# Altium project OBC Development Board.PrjPcb
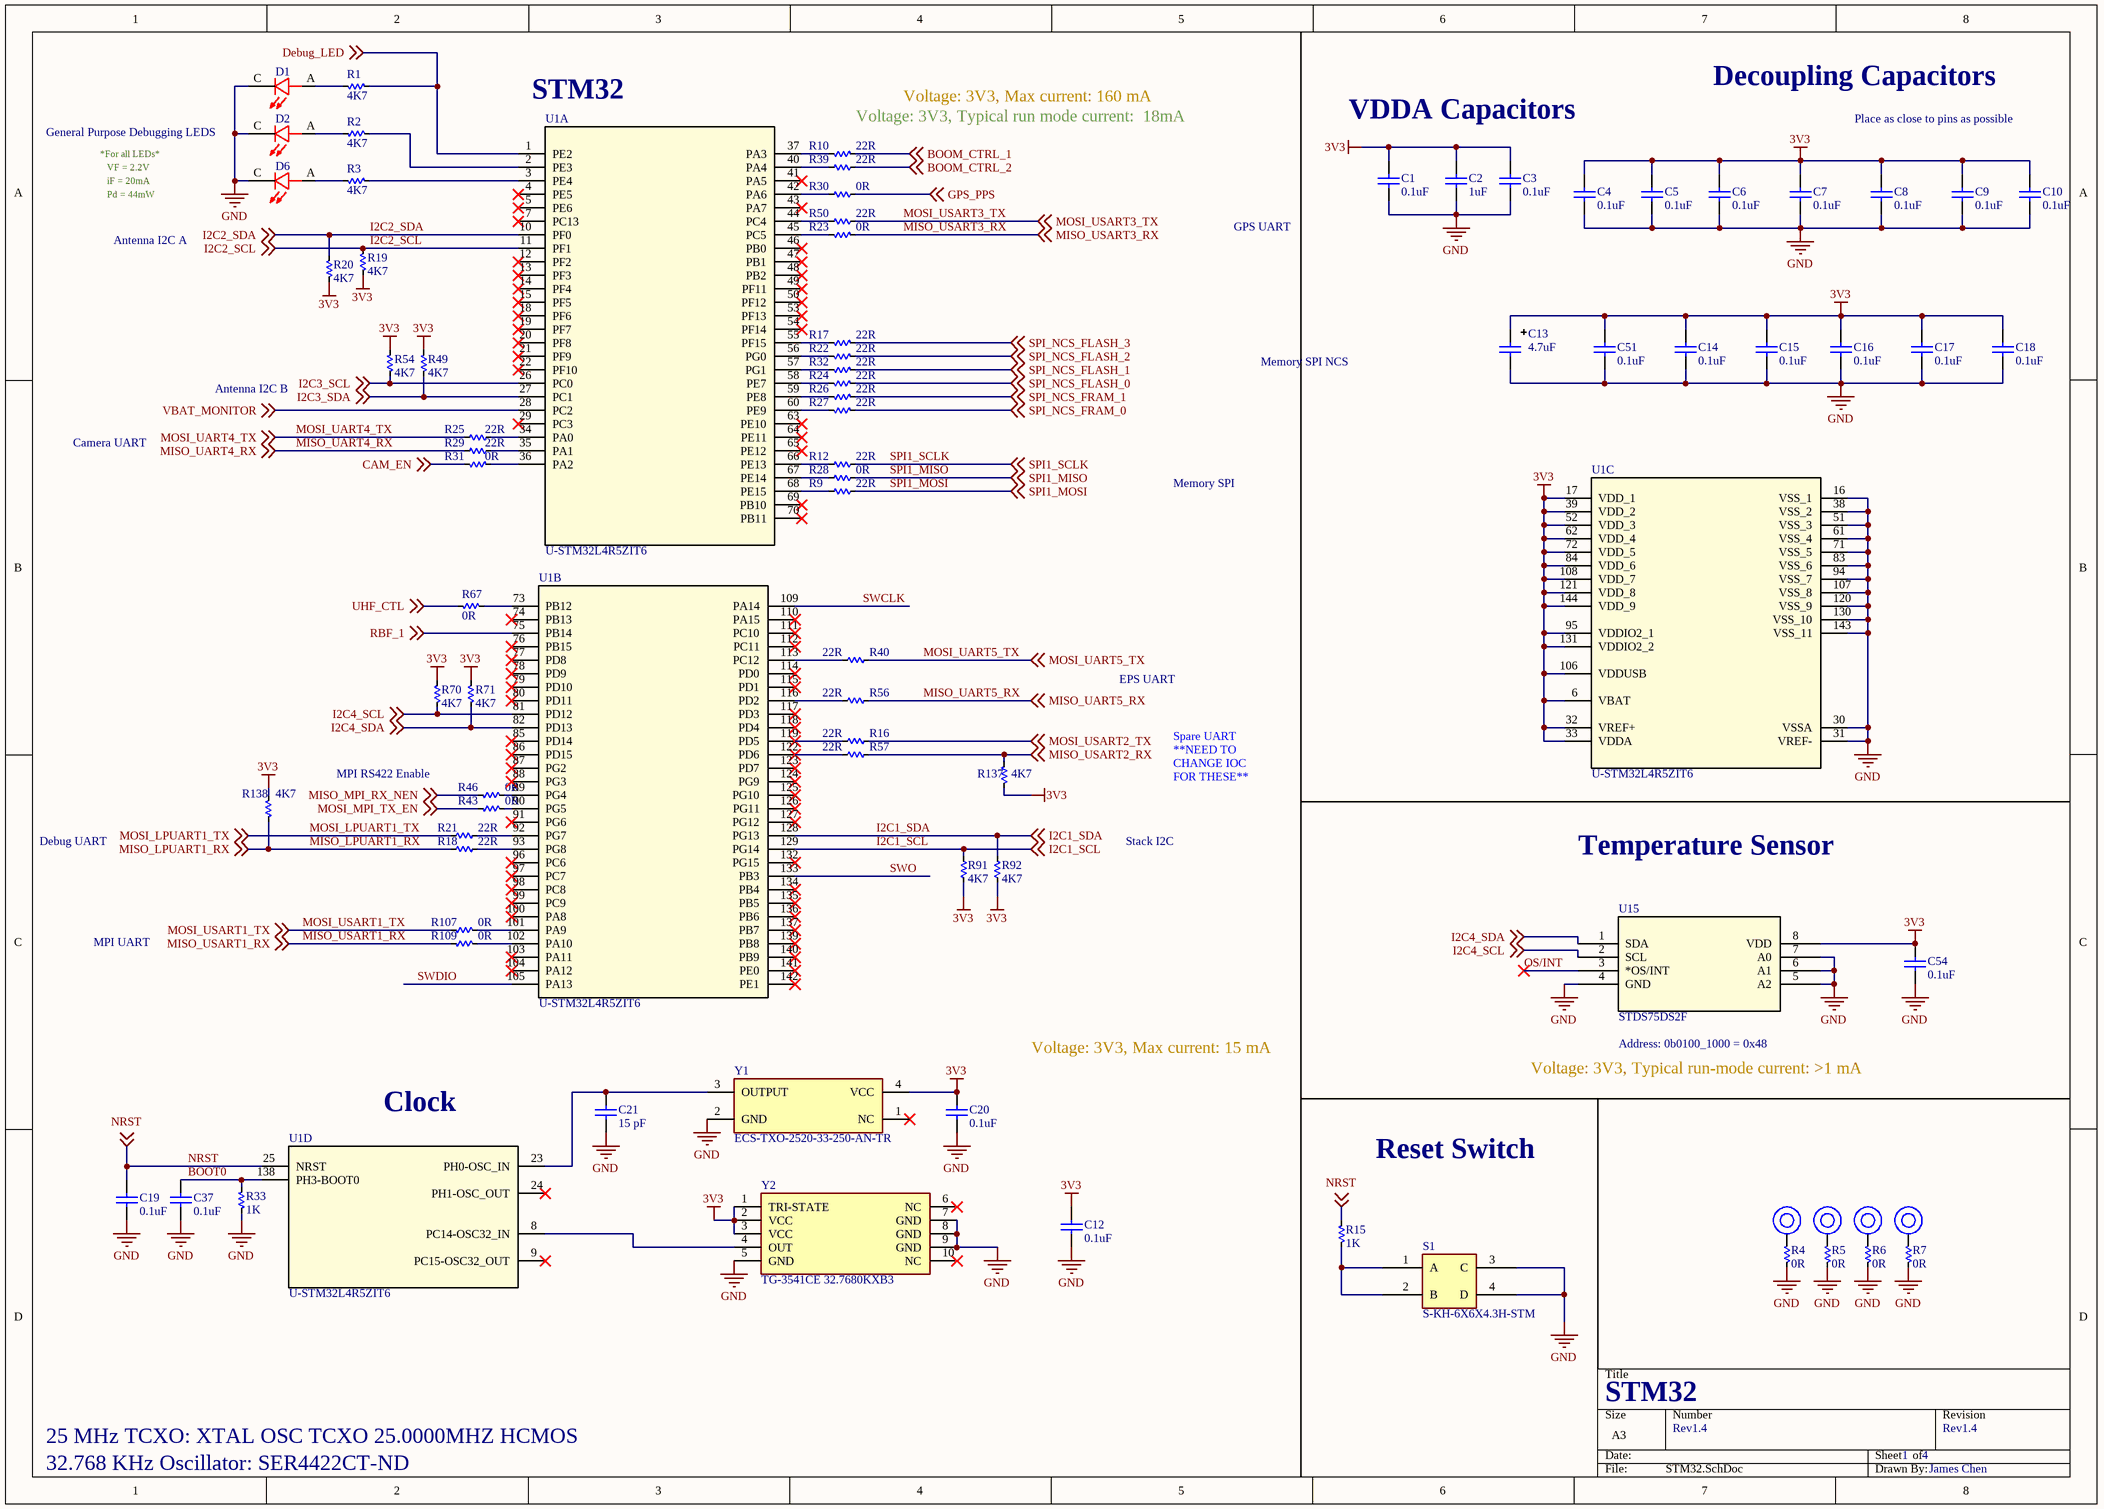
[diagram p0: STM32.SchDoc]
4 sheets, 225 parts. Net scope: global (net labels, ports and power ports of the same name join across sheets).
Board file: OBC Development Board.PcbDoc
Sheets:
  STM32.SchDoc
  Memory.SchDoc
  External Connectors.SchDoc
  Antenna and LoRa.SchDoc

## Sheet STM32.SchDoc
size A3; SheetNumber: 1; SheetTotal: 4

### Parts
*1  PC104 Mounting  [PC104 Mounting Points]  (value not drawn)  (no BOM)
*2  PC104 Mounting  [PC104 Mounting Points]  (value not drawn)  (no BOM)
*3  PC104 Mounting  [PC104 Mounting Points]  (value not drawn)  (no BOM)
*4  PC104 Mounting  [PC104 Mounting Points]  (value not drawn)  (no BOM)
C1  0.1uF  [0603]
C2  1uF  [0603]
C3  0.1uF  [0603]
C4  0.1uF  [0603]
C5  0.1uF  [0603]
C6  0.1uF  [0603]
C7  0.1uF  [0603]
C8  0.1uF  [0603]
C9  0.1uF  [0603]
C10  0.1uF  [0603]
C12  0.1uF  [0603]
C13  4.7uF  [CAP TANT 1206 (A) TCJ]
C14  0.1uF  [0603]
C15  0.1uF  [0603]
C16  0.1uF  [0603]
C17  0.1uF  [0603]
C18  0.1uF  [0603]
C19  0.1uF  [0603]
C20  0.1uF  [0603]
C21  15 pF  [0402]
C37  0.1uF  [0402]
C51  0.1uF  [0603]
C54  0.1uF  [0603]
D1  D-SML-D12U1WT86  [D-SML-D12U1WT86]  (value not drawn)
D2  D-SML-D12U1WT86  [D-SML-D12U1WT86]  (value not drawn)
D6  D-SML-D12U1WT86  [D-SML-D12U1WT86]  (value not drawn)
R1  4K7  [0603]
R2  4K7  [0603]
R3  4K7  [0603]
R4  value 0R  [0603]  (hidden comment: 0R DNP)
R5  value 0R  [0603]  (hidden comment: 0R DNP)
R6  value 0R  [0603]  (hidden comment: 0R DNP)
R7  value 0R  [0603]  (hidden comment: 0R DNP)
R9  22R  [0603]
R10  22R  [0603]
R12  22R  [0603]
R15  1K  [0603]
R16  22R  [0603]
R17  22R  [0603]
R18  22R  [0603]
R19  4K7  [0603]
R20  4K7  [0603]
R21  22R  [0603]
R22  22R  [0603]
R23  0R  [0603]
R24  22R  [0603]
R25  22R  [0603]
R26  22R  [0603]
R27  22R  [0603]
R28  0R  [0603]
R29  22R  [0603]
R30  0R  [0603]
R31  0R  [0603]
R32  22R  [0603]
R33  1K  [0603]
R39  22R  [0603]
R40  22R  [0603]
R43  0R  [0603]
R46  0R  [0603]
R49  4K7  [0603]
R50  22R  [0603]
R54  4K7  [0603]
R56  22R  [0603]
R57  22R  [0603]
R67  0R  [0603]
R70  4K7  [0603]
R71  4K7  [0603]
R91  4K7  [0603]
R92  4K7  [0603]
R107  0R  [0603]
R109  0R  [0603]
R137  4K7  [0603]
R138  4K7  [0603]
S1  S-KH-6X6X4.3H-STM  [S-KH-6X6X4.3H-STM]
U1  U-STM32L4R5ZIT6  [U-STM32L4R5ZIT6]  (parts A,B,C,D of 4)
U15  STDS75DS2F  [MSOP-8_STM-M]
Y1  ECS-TXO-2520-33-250-AN-TR  [Y-ECS-TXO-2520-33-250-AN-TR]
Y2  TG-3541CE 32.7680KXB3  [Y-TG-3541CE 32.7680KXB3]

### Nets
3V3: C1.2 C2.2 C3.2 C4.2 C5.2 C6.2 C7.2 C8.2 C9.2 C10.2 C12.2 C13.1 C14.2 C15.2 C16.2 C17.2 C18.2 C20.2 C51.2 C54.2 R19.1 R20.1 R49.1 R54.1 R70.1 R71.1 R91.2 R92.1 R137.2 R138.1 U1.6(VBAT) U1.17(VDD_1) U1.32(VREF+) U1.33(VDDA) U1.39(VDD_2) U1.52(VDD_3) U1.62(VDD_4) U1.72(VDD_5) U1.84(VDD_6) U1.95(VDDIO2_1) U1.106(VDDUSB) U1.108(VDD_7) U1.121(VDD_8) U1.131(VDDIO2_2) U1.144(VDD_9) U15.8(VDD) Y1.4(VCC) Y2.1(TRI-STATE) Y2.2(VCC) Y2.3(VCC)
GND: C1.1 C2.1 C3.1 C4.1 C5.1 C6.1 C7.1 C8.1 C9.1 C10.1 C12.1 C13.2 C14.1 C15.1 C16.1 C17.1 C18.1 C19.1 C20.1 C21.2 C37.2 C51.1 C54.1 D1.C D2.C D6.C R4.1 R5.1 R6.1 R7.1 R33.1 S1.3(C) S1.4(D) U1.16(VSS_1) U1.30(VSSA) U1.31(VREF-) U1.38(VSS_2) U1.51(VSS_3) U1.61(VSS_4) U1.71(VSS_5) U1.83(VSS_6) U1.94(VSS_7) U1.107(VSS_8) U1.120(VSS_9) U1.130(VSS_10) U1.143(VSS_11) U15.4(GND) U15.5(A2) U15.6(A1) U15.7(A0) Y1.2(GND) Y2.5(GND) Y2.7(GND) Y2.8(GND) Y2.9(GND)
BOOM_CTRL_1: R10.2 ; off-sheet BOOM_CTRL_1
BOOM_CTRL_2: R39.1 ; off-sheet BOOM_CTRL_2
BOOT0: C37.1 R33.2 U1.138(PH3-BOOT0)
CAM_EN: R31.1 ; off-sheet CAM_EN
Debug_LED: R1.2 U1.1(PE2) ; off-sheet Debug_LED
GPS_PPS: R30.2 ; off-sheet GPS_PPS
I2C1_SCL: R91.1 U1.129(PG14) ; off-sheet I2C1_SCL
I2C1_SDA: R92.2 U1.128(PG13) ; off-sheet I2C1_SDA
I2C2_SCL: R19.2 U1.11(PF1) ; off-sheet I2C2_SCL
I2C2_SDA: R20.2 U1.10(PF0) ; off-sheet I2C2_SDA
I2C3_SCL: R54.2 U1.26(PC0) ; off-sheet I2C3_SCL
I2C3_SDA: R49.2 U1.27(PC1) ; off-sheet I2C3_SDA
I2C4_SCL: R70.2 U1.81(PD12) U15.2(SCL) ; off-sheet I2C4_SCL
I2C4_SDA: R71.2 U1.82(PD13) U15.1(SDA) ; off-sheet I2C4_SDA
MISO_LPUART1_RX: R18.1 R138.2 ; off-sheet MISO_LPUART1_RX
MISO_MPI_RX_NEN: R46.2 ; off-sheet MISO_MPI_RX_NEN
MISO_UART4_RX: R29.1 ; off-sheet MISO_UART4_RX
MISO_UART5_RX: R56.2 ; off-sheet MISO_UART5_RX
MISO_USART1_RX: R109.1 ; off-sheet MISO_USART1_RX
MISO_USART2_RX: R57.2 R137.1 ; off-sheet MISO_USART2_RX
MISO_USART3_RX: R23.2 ; off-sheet MISO_USART3_RX
MOSI_LPUART1_TX: R21.1 ; off-sheet MOSI_LPUART1_TX
MOSI_MPI_TX_EN: R43.2 ; off-sheet MOSI_MPI_TX_EN
MOSI_UART4_TX: R25.1 ; off-sheet MOSI_UART4_TX
MOSI_UART5_TX: R40.2 ; off-sheet MOSI_UART5_TX
MOSI_USART1_TX: R107.1 ; off-sheet MOSI_USART1_TX
MOSI_USART2_TX: R16.2 ; off-sheet MOSI_USART2_TX
MOSI_USART3_TX: R50.1 ; off-sheet MOSI_USART3_TX
NRST: C19.2 R15.2 U1.25(NRST) ; off-sheet NRST
OS/INT: U15.3(*OS/INT)
RBF_1: U1.75(PB14) ; off-sheet RBF_1
SPI1_MISO: R28.2 ; off-sheet SPI1_MISO
SPI1_MOSI: R9.1 ; off-sheet SPI1_MOSI
SPI1_SCLK: R12.1 ; off-sheet SPI1_SCLK
SPI_NCS_FLASH_0: R24.2 ; off-sheet SPI_NCS_FLASH_0
SPI_NCS_FLASH_1: R32.2 ; off-sheet SPI_NCS_FLASH_1
SPI_NCS_FLASH_2: R22.2 ; off-sheet SPI_NCS_FLASH_2
SPI_NCS_FLASH_3: R17.2 ; off-sheet SPI_NCS_FLASH_3
SPI_NCS_FRAM_0: R27.2 ; off-sheet SPI_NCS_FRAM_0
SPI_NCS_FRAM_1: R26.2 ; off-sheet SPI_NCS_FRAM_1
SWCLK: U1.109(PA14)
SWDIO: U1.105(PA13)
SWO: U1.133(PB3)
UHF_CTL: R67.1 ; off-sheet UHF_CTL
VBAT_MONITOR: U1.28(PC2) ; off-sheet VBAT_MONITOR
Net*1_1: *1.1 R4.2
Net*2_1: *2.1 R5.2
Net*3_1: *3.1 R6.2
Net*4_1: *4.1 R7.2
NetC21_1: C21.1 U1.23(PH0-OSC_IN) Y1.3(OUTPUT)
NetD1_A: D1.A R1.1
NetD2_A: D2.A R2.1
NetD6_A: D6.A R3.2
NetR2_2: R2.2 U1.2(PE3)
NetR3_1: R3.1 U1.3(PE4)
NetR9_2: R9.2 U1.68(PE15)
NetR10_1: R10.1 U1.37(PA3)
NetR12_2: R12.2 U1.66(PE13)
NetR15_1: R15.1 S1.1(A) S1.2(B)
NetR16_1: R16.1 U1.119(PD5)
NetR17_1: R17.1 U1.55(PF15)
NetR18_2: R18.2 U1.93(PG8)
NetR21_2: R21.2 U1.92(PG7)
NetR22_1: R22.1 U1.56(PG0)
NetR23_1: R23.1 U1.45(PC5)
NetR24_1: R24.1 U1.58(PE7)
NetR25_2: R25.2 U1.34(PA0)
NetR26_1: R26.1 U1.59(PE8)
NetR27_1: R27.1 U1.60(PE9)
NetR28_1: R28.1 U1.67(PE14)
NetR29_2: R29.2 U1.35(PA1)
NetR30_1: R30.1 U1.42(PA6)
NetR31_2: R31.2 U1.36(PA2)
NetR32_1: R32.1 U1.57(PG1)
NetR39_2: R39.2 U1.40(PA4)
NetR40_1: R40.1 U1.113(PC12)
NetR43_1: R43.1 U1.90(PG5)
NetR46_1: R46.1 U1.89(PG4)
NetR50_2: R50.2 U1.44(PC4)
NetR56_1: R56.1 U1.116(PD2)
NetR57_1: R57.1 U1.122(PD6)
NetR67_2: R67.2 U1.73(PB12)
NetR107_2: R107.2 U1.101(PA9)
NetR109_2: R109.2 U1.102(PA10)
NetU1_8: U1.8(PC14-OSC32_IN) Y2.4(OUT)

Not connected (* = marked no-connect by the designer): U1 4(PE5)* 5(PE6)* 7(PC13)* 9(PC15-OSC32_OUT)* 12(PF2)* 13(PF3)* 14(PF4)* 15(PF5)* 18(PF6)* 19(PF7)* 20(PF8)* 21(PF9)* 22(PF10)* 24(PH1-OSC_OUT)* 29(PC3)* 41(PA5)* 43(PA7)* 46(PB0)* 47(PB1)* 48(PB2)* 49(PF11)* 50(PF12)* 53(PF13)* 54(PF14)* 63(PE10)* 64(PE11)* 65(PE12)* 69(PB10)* 70(PB11)* 74(PB13)* 76(PB15)* 77(PD8)* 78(PD9)* 79(PD10)* 80(PD11)* 85(PD14)* 86(PD15)* 87(PG2)* 88(PG3)* 91(PG6)* 96(PC6)* 97(PC7)* 98(PC8)* 99(PC9)* 100(PA8)* 103(PA11)* 104(PA12)* 110(PA15)* 111(PC10)* 112(PC11)* 114(PD0)* 115(PD1)* 117(PD3)* 118(PD4)* 123(PD7)* 124(PG9)* 125(PG10)* 126(PG11)* 127(PG12)* 132(PG15)* 134(PB4)* 135(PB5)* 136(PB6)* 137(PB7)* 139(PB8)* 140(PB9)* 141(PE0)* 142(PE1)*; Y1 1(NC)*; Y2 6(NC)* 10(NC)*

### Notes on the sheet
- (near U1) STM32
- Voltage: 3V3, Max current: 160 mA
- Decoupling Capacitors
- General Purpose Debugging LEDS
- *For all LEDs*
- VF = 2.2V
- iF = 20mA
- Voltage: 3V3, Typical run mode current:  18mA
- VDDA Capacitors
- Place as close to pins as possible
- Pd = 44mW
- Antenna I2C A
- GPS UART
- Memory SPI NCS
- Camera UART
- Antenna I2C B
- Memory SPI
- EPS UART
- MPI RS422 Enable
- Spare UART **NEED TO CHANGE IOC FOR THESE**
- Debug UART
- Stack I2C
- Temperature Sensor
- MPI UART
- Voltage: 3V3, Max current: 15 mA
- Address: 0b0100_1000 = 0x48
- (near U1) Clock
- Voltage: 3V3, Typical run-mode current: >1 mA
- Reset Switch
- 25 MHz TCXO: XTAL OSC TCXO 25.0000MHZ HCMOS
- STM32
- Rev1.4
- 1
- 4
- 32.768 KHz Oscillator: SER4422CT-ND
- James Chen

### Library data of the parts
C1 C3-C10 C14-C19 C51 = CC-100nF-25V-X7R-0603: 25V 100nF X7R ±10% 0603 Multilayer Ceramic Capacitors MLCC - SMD/SMT ROHS; Manufacturer: Murata Electronics; Manufacturer Part #: GCJ188R71E104KA12D; Max Exposed Voltage: 6; Rated Voltage: 25; ComponentLink1description: Datasheet; ComponentLink1URL: https://ds.yuden.co.jp/TYCOMPAS/ut/detail?pn=TMK105BJ104KV-F%20%20&u=M; ComponentLink2description: Manufacturer Website; Distributor: LCSC; Distributor Part #: C354391; Part Description: 25V 100nF X7R ±10% 0603 Multilayer Ceramic Capacitors MLCC - SMD/SMT ROHS; ComponentLink2URL: https://www.yuden.co.jp/or/; Value: 0.1uF; Highest Rated Operating Temperature: 125; Lowest Rated Operating Temperature: -55
C2 = CC-105-K-25V-X7R-0603: CAP CER 1UF 25V X7R 0603; Manufacturer: Yageo; Manufacturer Part #: CC0603KRX7R8BB105; ComponentLink1Description: Datasheet; ComponentLink1URL: https://www.yageo.com/upload/media/product/productsearch/datasheet/mlcc/UPY-GPHC_X7R_6.3V-to-50V_18.pdf; ComponentLink2Description: Manufacture Website; ComponentLink2URL: https://www.yageo.com/en/Home; Distributor: Digikey; Distributor Part #: 311-1802-1-ND; Part Description: CAP CER 1UF 25V X7R 0603; SignalCraft Part #: CC-105-K-25V-X7R-0603; Value: 1uF
C12 C20 C54 = CC-100nF-25V-X7R-0603: 25V 100nF X7R ±10% 0603 Multilayer Ceramic Capacitors MLCC - SMD/SMT ROHS; Manufacturer: Murata Electronics; Manufacturer Part #: GCJ188R71E104KA12D; Rated Voltage: 25; Max Exposed Voltage: 6; ComponentLink1description: Datasheet; ComponentLink1URL: https://ds.yuden.co.jp/TYCOMPAS/ut/detail?pn=TMK105BJ104KV-F%20%20&u=M; ComponentLink2description: Manufacturer Website; Distributor: LCSC; Distributor Part #: C354391; Part Description: 25V 100nF X7R ±10% 0603 Multilayer Ceramic Capacitors MLCC - SMD/SMT ROHS; ComponentLink2URL: https://www.yuden.co.jp/or/; Value: 0.1uF; Lowest Rated Operating Temperature: -55; Highest Rated Operating Temperature: 125
C13 = CT-474-M-20V-OTH-1206: 4.7 µF Molded Tantalum Capacitors 20 V 1206 (3216 Metric) 4Ohm; Manufacturer: AVX Corporation; Manufacturer Part #: TAJA475K020RNJ; ComponentLink1Description: Datasheet; ComponentLink1URL: *; ComponentLink2Description: Manufacturer Website; ComponentLink2URL: *; Distributor: Digikey; Distributor Part #: 478-1668-1-ND; Part Description: 4.7 µF Molded Tantalum Capacitors 20 V 1206 (3216 Metric) 4Ohm; Value: 4.7uF
C21 = CC-159-J-50V-C0G-0402: 15 pF ±1% 50V Ceramic Capacitor C0G, NP0 0402 (1005 Metric); Manufacturer: YAGEO; Manufacturer Part #: CC0402FRNPO9BN150; ComponentLink1Description: Datasheet; ComponentLink1URL: *; ComponentLink2Description: Manufacture Website; ComponentLink2URL: *; Distributor: Digikey; Distributor Part #: 311-1642-1-ND; Part Description: 15 pF ±1% 50V Ceramic Capacitor C0G, NP0 0402 (1005 Metric); Value: 15 pF
C37 = CC-104-K-25V-X7R-0402: CAP CER 0.1UF 25V X7R 0402; Manufacturer: YAGEO; Manufacturer Part #: CC0402KPX7R8BB104; ComponentLink1description: Datasheet; ComponentLink1URL: https://ds.yuden.co.jp/TYCOMPAS/ut/detail?pn=TMK105BJ104KV-F%20%20&u=M; ComponentLink2description: Manufacturer Website; Distributor: Digikey; Distributor Part #: 13-CC0402KPX7R8BB104CT-ND; Part Description: CAP CER 0.1UF 25V X7R 0402; ComponentLink2URL: https://www.yuden.co.jp/or/; Value: 0.1uF
D1 D2 D6 = D-SML-D12U1WT86: Red 620nm LED Indication - Discrete 2.2V 0603 _1608 Metric; Manufacturer: Rohm Semiconductor; Manufacturer Part #: SML-D12U1WT86; Distributor: Digikey; Distributor Part #: SML-D12U1WT86CT-ND
R1-R3 R19 R20 R49 R54 R70 R71 R91 R92 R137 R138 = RT-4K7-F-1/16W-0603: RES SMD 4.7K OHM 1% 1/10W 0603; Manufacturer: Bourns Inc.; Manufacturer Part #: CR0603-FX-4701ELF; ComponentLink1description: Datasheet; ComponentLink1URL: https://www.vishay.com/docs/20035/dcrcwe3.pdf; ComponentLink2description: Manufacturer Website; Distributor: Digikey; Distributor Part #: CR0603-FX-4701ELFCT-ND; Part Description: RES SMD 4.7K OHM 1% 1/10W 0603; ComponentLink2URL: https://www.vishay.com/; Value: 4K7
R4-R7 R23 R28 R30 R31 R43 R46 R67 R107 R109 = RT-0R00-F-1/10W-0603: 0 Ohms Jumper 0.1W, 1/10W Chip Resistor 0603 (1608 Metric) Automotive AEC-Q200 Thick Film; Manufacturer: Stackpole Electronics Inc; Manufacturer Part #: RMCF0603ZT0R00; ComponentLink1description: Datasheet; ComponentLink1URL: https://industrial.panasonic.com/ww/products/resistors/chip-resistors/general-purpose-chip-resistors/models/ERJ2GE0R00X; ComponentLink2description: Manufacturer Website; Distributor: Digikey; Distributor Part #: RMCF0603ZT0R00CT-ND; Part Description: 0 Ohms Jumper 0.1W, 1/10W Chip Resistor 0603 (1608 Metric) Automotive AEC-Q200 Thick Film; ComponentLink2URL: https://industrial.panasonic.com/ww/products/resistors/chip-resistors/general-purpose-chip-resistors/models/ERJ2GE0R00X
  R23 R28 R30 R31 R43 R46 R67 R107 R109: Value: 0R
R9 R10 R12 R16-R18 R21 R22 R24-R27 R29 R32 R39 R40 R50 R56 R57 = RT-22R0-F-1/16W-0603: 22 Ohms ±0.5% 0.063W, 1/16W Chip Resistor 0603 (1608 Metric) - Thin Film; Manufacturer: Susumu; Manufacturer Part #: RR0816Q-220-D; ComponentLink1description: Datasheet; ComponentLink1URL: https://www.vishay.com/docs/20035/dcrcwe3.pdf; ComponentLink2description: Manufacturer Website; Distributor: Digikey; Distributor Part #: RR08Q22DCT-ND; Part Description: 22 Ohms ±0.5% 0.063W, 1/16W Chip Resistor 0603 (1608 Metric) - Thin Film; ComponentLink2URL: https://www.vishay.com/; Value: 22R
R15 R33 = RT-1K0-F-1/16W-0603: RES SMD 1K OHM 1% 1/16W 0603; Manufacturer: TE Connectivity Passive Product; Manufacturer Part #: CPF0603F1K0C1; ComponentLink1description: Datasheet; ComponentLink1URL: https://www.vishay.com/docs/20035/dcrcwe3.pdf; ComponentLink2description: Manufacturer Website; Distributor: Digikey; Distributor Part #: A102226CT-ND; Part Description: RES SMD 1K OHM 1% 1/16W 0603; ComponentLink2URL: https://www.vishay.com/; Value: 1K
S1 = S-KH-6X6X4.3H-STM: NO 50mA Brick nogging SPST 80000次 12V SMD Tactile Switches ROHS; Manufacturer: Shenzhen Kinghelm Elec; Manufacturer Part #: KH-6X6X4.3H-STM; Distributor: LCSC; Distributor Part #: C2837530; LCSC Part #: C2837530
U1 = U-STM32L4R5ZIT6: IC MCU 32BIT 2MB FLASH 144LQFP; Manufacturer: STMicroelectronics; Distributor: Mouser; Manufacturer Part #: STM32L4R5ZIT6; Mouser Part Number: 511-STM32L4R5ZIT6P; LCSC Part #: C1339786
U15 = U-STDS75DS2F: MSOP-8 Temperature Sensors ROHS; Manufacturer: STMicroelectronics; Distributor: LCSC; Distributor Part #: C283289; Manufacturer Part #: STDS75DS2F; LCSC Part #: C283289
Y1 = Y-ECS-TXO-2520-33-250-AN-TR: XTAL OSC TCXO 25.0000MHZ HCMOS; Manufacturer: ECS Inc.; Manufacturer Part #: ECS-TXO-2520-33-250-AN-TR; Distributor: Digikey; Distributor Part #: XC2258CT-ND
Y2 = Y-TG-3541CE 32.7680KXB3: XTAL OSC TCXO 32.7680KHZ CMOS; Manufacturer: EPSON; Manufacturer Part #: TG-3541CE 32.7680KXB3; Distributor: Digikey; Distributor Part #: SER4422CT-ND

## Sheet Memory.SchDoc: Microcontroller
size A3; DrawnBy: James Chen; Revision: 1.0; SheetNumber: 2; SheetTotal: 4
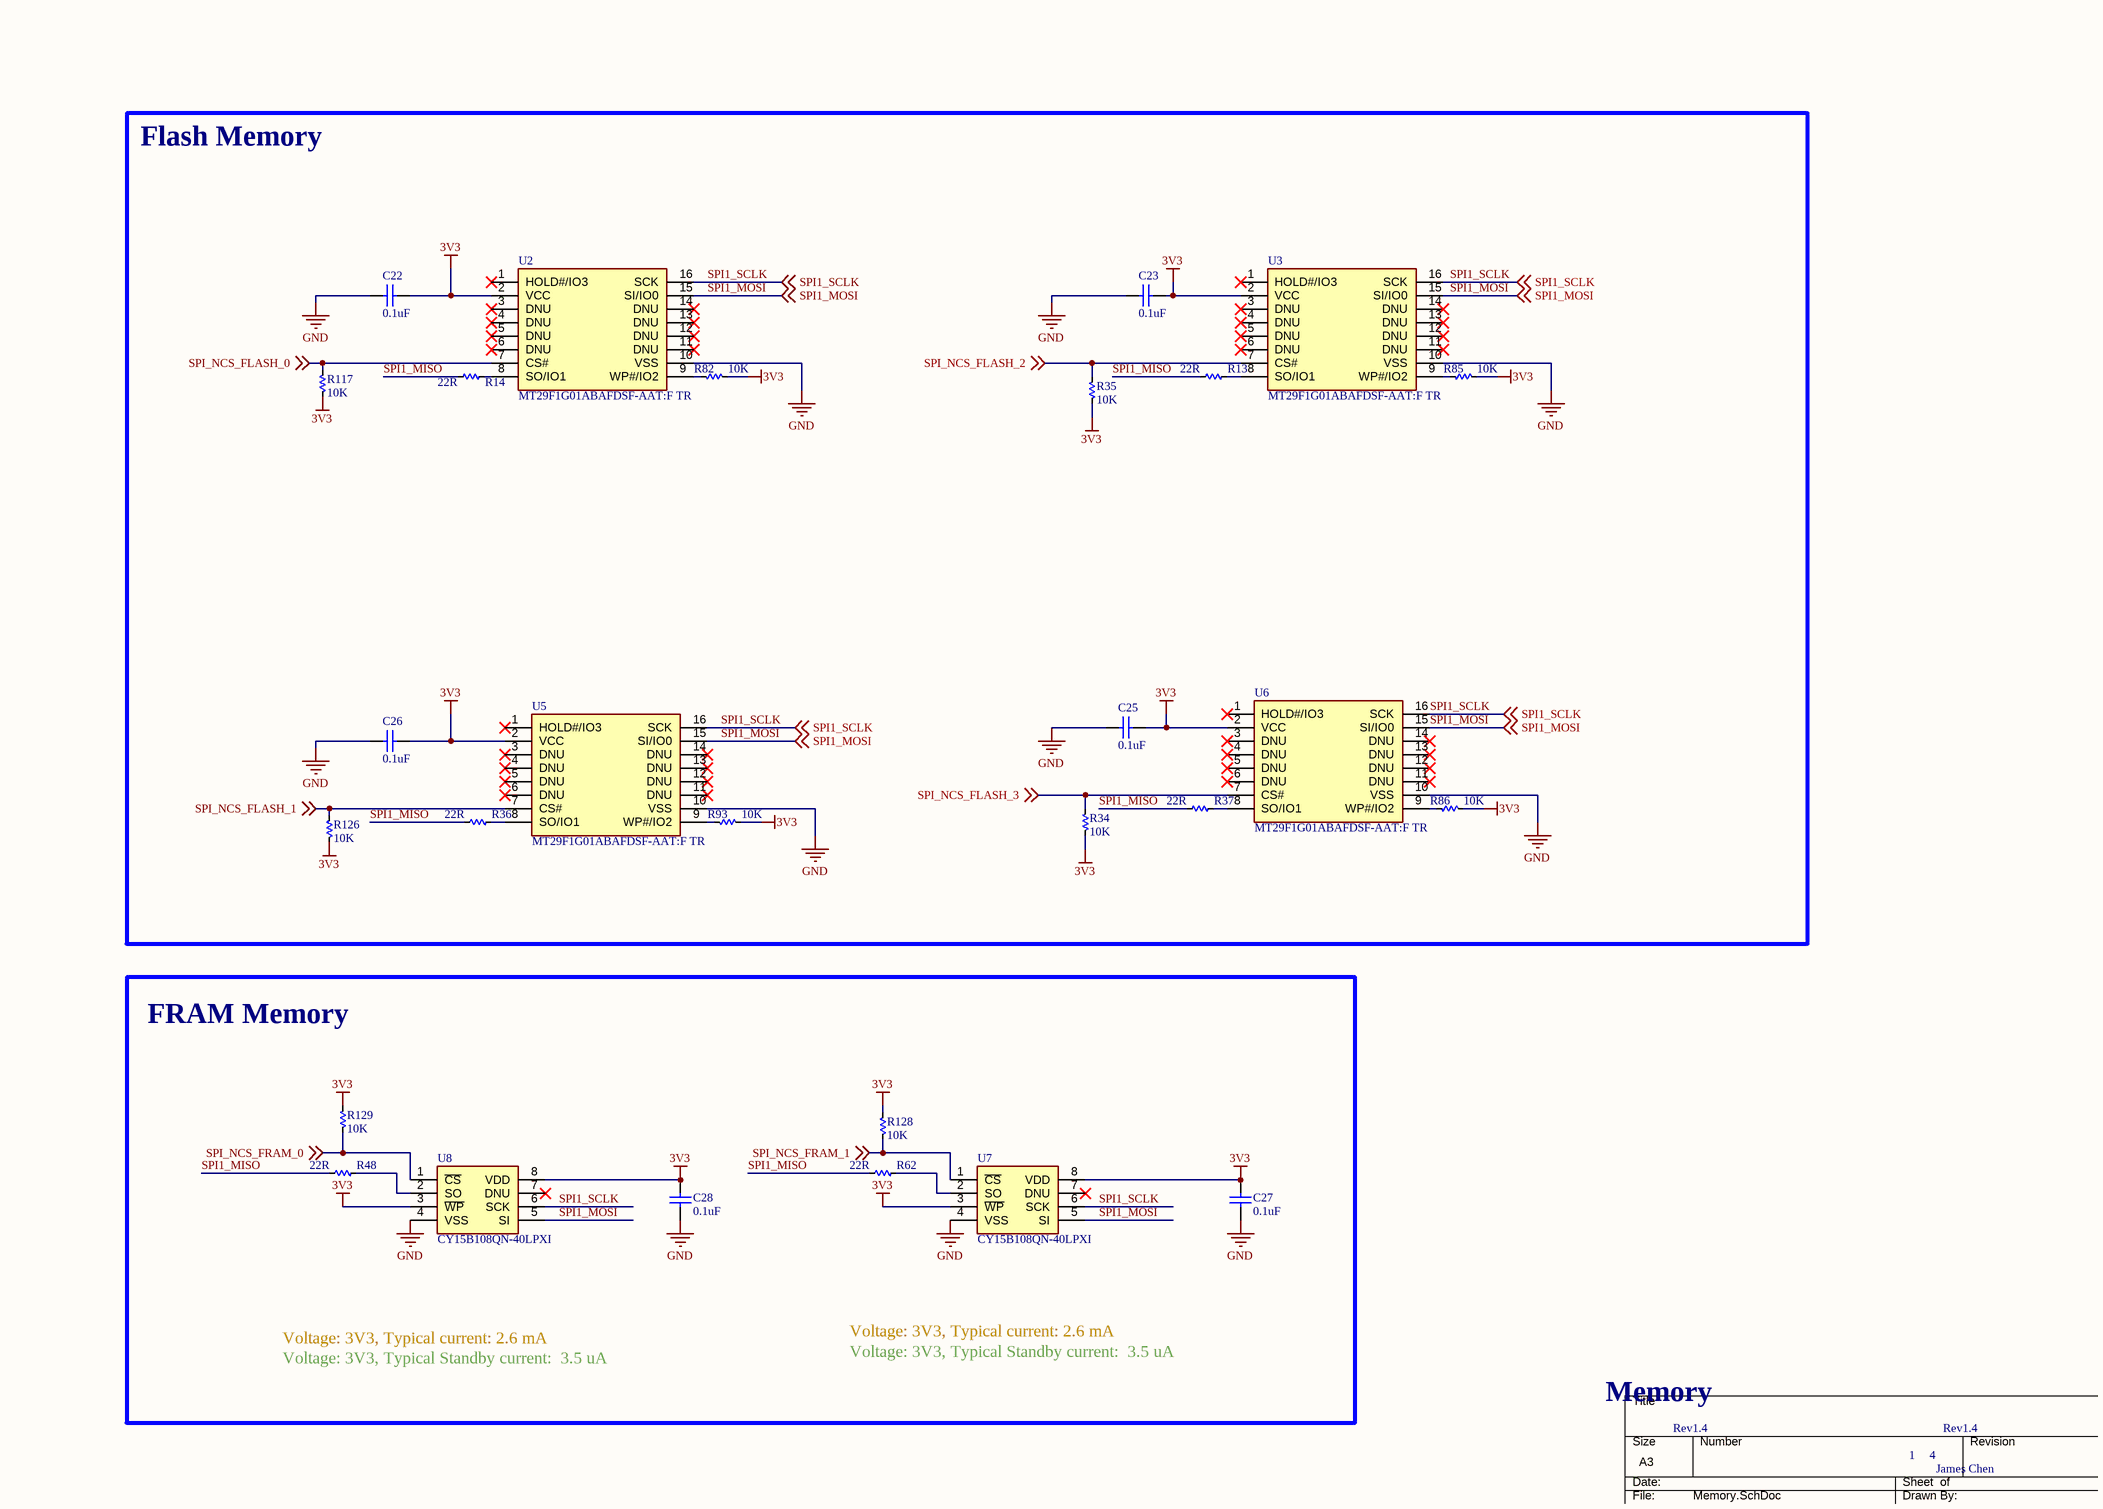
[diagram p1: Memory.SchDoc]

### Parts
C22  0.1uF  [0603]
C23  0.1uF  [0603]
C25  0.1uF  [0603]
C26  0.1uF  [0603]
C27  0.1uF  [0603]
C28  0.1uF  [0603]
R13  22R  [0603]
R14  22R  [0603]
R34  10K  [0603]
R35  10K  [0603]
R36  22R  [0603]
R37  22R  [0603]
R48  22R  [0603]
R62  22R  [0603]
R82  10K  [0603]
R85  10K  [0603]
R86  10K  [0603]
R93  10K  [0603]
R117  10K  [0603]
R126  10K  [0603]
R128  10K  [0603]
R129  10K  [0603]
U2  MT29F1G01ABAFDSF-AAT:F TR  [U-MT29F1G01ABAFDSF-AAT:F TR]
U3  MT29F1G01ABAFDSF-AAT:F TR  [U-MT29F1G01ABAFDSF-AAT:F TR]
U5  MT29F1G01ABAFDSF-AAT:F TR  [U-MT29F1G01ABAFDSF-AAT:F TR]
U6  MT29F1G01ABAFDSF-AAT:F TR  [U-MT29F1G01ABAFDSF-AAT:F TR]
U7  CY15B108QN-40LPXI  [U-CY15B108QN-40LPXI]
U8  CY15B108QN-40LPXI  [U-CY15B108QN-40LPXI]

### Blocks framed on the sheet
Flash Memory: C22 C23 C25 C26 R13 R14 R34-R37 R82 R85 R86 R93 R117 R126 U2 U3 U5 U6
FRAM Memory: C27 C28 R48 R62 R128 R129 U7 U8

### Nets
3V3: C22.1 C23.2 C25.2 C26.1 C27.1 C28.1 R34.1 R35.1 R82.1 R85.1 R86.1 R93.1 R117.1 R126.1 R128.1 R129.1 U2.2(VCC) U3.2(VCC) U5.2(VCC) U6.2(VCC) U7.3(~{WP}) U7.8(VDD) U8.3(~{WP}) U8.8(VDD)
GND: C22.2 C23.1 C25.1 C26.2 C27.2 C28.2 U2.10(VSS) U3.10(VSS) U5.10(VSS) U6.10(VSS) U7.4(VSS) U8.4(VSS)
SPI1_MISO: R13.1 R14.1 R36.1 R37.1 R48.1 R62.1
SPI1_MOSI: U2.15(SI/IO0) U3.15(SI/IO0) U5.15(SI/IO0) U6.15(SI/IO0) U7.5(SI) U8.5(SI) ; off-sheet SPI1_MOSI
SPI1_SCLK: U2.16(SCK) U3.16(SCK) U5.16(SCK) U6.16(SCK) U7.6(SCK) U8.6(SCK) ; off-sheet SPI1_SCLK
SPI_NCS_FLASH_0: R117.2 U2.7(CS#) ; off-sheet SPI_NCS_FLASH_0
SPI_NCS_FLASH_1: R126.2 U5.7(CS#) ; off-sheet SPI_NCS_FLASH_1
SPI_NCS_FLASH_2: R35.2 U3.7(CS#) ; off-sheet SPI_NCS_FLASH_2
SPI_NCS_FLASH_3: R34.2 U6.7(CS#) ; off-sheet SPI_NCS_FLASH_3
SPI_NCS_FRAM_0: R129.2 U8.1(~{CS}) ; off-sheet SPI_NCS_FRAM_0
SPI_NCS_FRAM_1: R128.2 U7.1(~{CS}) ; off-sheet SPI_NCS_FRAM_1
NetR13_2: R13.2 U3.8(SO/IO1)
NetR14_2: R14.2 U2.8(SO/IO1)
NetR36_2: R36.2 U5.8(SO/IO1)
NetR37_2: R37.2 U6.8(SO/IO1)
NetR48_2: R48.2 U8.2(SO)
NetR62_2: R62.2 U7.2(SO)
NetR82_2: R82.2 U2.9(WP#/IO2)
NetR85_2: R85.2 U3.9(WP#/IO2)
NetR86_2: R86.2 U6.9(WP#/IO2)
NetR93_2: R93.2 U5.9(WP#/IO2)

Not connected (* = marked no-connect by the designer): U2 1(HOLD#/IO3)* 3(DNU)* 4(DNU)* 5(DNU)* 6(DNU)* 11(DNU)* 12(DNU)* 13(DNU)* 14(DNU)*; U3 1(HOLD#/IO3)* 3(DNU)* 4(DNU)* 5(DNU)* 6(DNU)* 11(DNU)* 12(DNU)* 13(DNU)* 14(DNU)*; U5 1(HOLD#/IO3)* 3(DNU)* 4(DNU)* 5(DNU)* 6(DNU)* 11(DNU)* 12(DNU)* 13(DNU)* 14(DNU)*; U6 1(HOLD#/IO3)* 3(DNU)* 4(DNU)* 5(DNU)* 6(DNU)* 11(DNU)* 12(DNU)* 13(DNU)* 14(DNU)*; U7 7(DNU)*; U8 7(DNU)*

### Notes on the sheet
- Voltage: 3V3, Typical current: 2.6 mA
- Voltage: 3V3, Typical Standby current:  3.5 uA
- Memory
- Rev1.4
- 1
- 4
- James Chen
- DWG NO:
- REV:
- THIS DOCUMENT AND THE DATA DISCLOSED HEREIN OR
- HEREWITH IS THE PROPERTY OF ALTIUM LIMITED AND MAY
- BE FREELY DISTRIBUTED IN WHOLE. NO RIGHTS ARE
- RESERVED OR EXPRESS OR IMPLIED WARANTEE GIVEN.
- REVISION
- DESCRIPTION
- DATE
- APPROVED
- ENG:
- APPROVALS
- PROJECT
- DSN:
- CHK:
- REFERENCE DOCUMENTS
- PROJECT REVISION:
- TITLE
- DOCUMENT REVISION:
- DESIGN ITEM:
- BOM:
- FAB DWG:
- PCB DWG:
- ASSY DWG:
- SCALE:
- A2
- SIZE
- CAGE CODE
- FILE NAME
- DWG NO.
- SHEET
- OF
- REV

### Library data of the parts
C22 C26-C28 = CC-100nF-25V-X7R-0603: as C1 on sheet STM32; ComponentLink1description: Datasheet; ComponentLink1URL: https://ds.yuden.co.jp/TYCOMPAS/ut/detail?pn=TMK105BJ104KV-F%20%20&u=M; ComponentLink2description: Manufacturer Website; Distributor: LCSC; Distributor Part #: C354391; Part Description: 25V 100nF X7R ±10% 0603 Multilayer Ceramic Capacitors MLCC - SMD/SMT ROHS; ComponentLink2URL: https://www.yuden.co.jp/or/; Value: 0.1uF; Highest Rated Operating Temperature: 125; Lowest Rated Operating Temperature: -55
C23 C25 = CC-100nF-25V-X7R-0603: as C12 on sheet STM32; ComponentLink1description: Datasheet; ComponentLink1URL: https://ds.yuden.co.jp/TYCOMPAS/ut/detail?pn=TMK105BJ104KV-F%20%20&u=M; ComponentLink2description: Manufacturer Website; Distributor: LCSC; Distributor Part #: C354391; Part Description: 25V 100nF X7R ±10% 0603 Multilayer Ceramic Capacitors MLCC - SMD/SMT ROHS; ComponentLink2URL: https://www.yuden.co.jp/or/; Lowest Rated Operating Temperature: -55; Highest Rated Operating Temperature: 125; Value: 0.1uF
R13 R14 R36 R37 R48 R62 = RT-22R0-F-1/16W-0603: as R9 on sheet STM32; ComponentLink1description: Datasheet; ComponentLink1URL: https://www.vishay.com/docs/20035/dcrcwe3.pdf; ComponentLink2description: Manufacturer Website; Distributor: Digikey; Distributor Part #: RR08Q22DCT-ND; Part Description: 22 Ohms ±0.5% 0.063W, 1/16W Chip Resistor 0603 (1608 Metric) - Thin Film; ComponentLink2URL: https://www.vishay.com/; Value: 22R
R34 R35 R82 R85 R86 R93 R117 R126 R128 R129 = RT-10K0-F-1/16W-0603: 10 kOhms ±0.1% 0.063W, 1/16W Chip Resistor 0603 (1608 Metric) - Thin Film; Manufacturer: TE Connectivity Passive Product; Manufacturer Part #: CPF0603B10KE; ComponentLink1description: Datasheet; ComponentLink1URL: https://www.vishay.com/docs/20035/dcrcwe3.pdf; ComponentLink2description: Manufacturer Website; Distributor: Digikey; Distributor Part #: A119886CT-ND; Part Description: 10 kOhms ±0.1% 0.063W, 1/16W Chip Resistor 0603 (1608 Metric) - Thin Film; ComponentLink2URL: https://www.vishay.com/; Value: 10K
U2 U3 U5 U6 = U-MT29F1G01ABAFDSF-AAT:F TR: IC FLASH 1GBIT SPI 16SO; Manufacturer: Micron Technology Inc.; Manufacturer Part #: MT29F1G01ABAFDSF-AAT:F TR; Distributer Part #: 557-1653-1-ND; Distributer: Digikey; ComponentLink1Description: Part Link; ComponentLink1URL: https://www.digikey.ca/en/products/detail/micron-technology-inc/MT29F1G01ABAFDSF-AAT-F-TR/6135560; ComponentLink2Description: Datasheet; ComponentLink2URL: https://www.farnell.com/datasheets/3151163.pdf
U7 U8 = U-CY15B108QN-40LPXI: IC FRAM 8MBIT SPI 40MHZ 8GQFN; Manufacturer: Cypress Semiconductor; Manufacturer Part #: CY15B108QN-40LPXI; Distributor: Digikey; Distributor Part #: 428-4723-ND

## Sheet External Connectors.SchDoc
size A3; SheetNumber: 3; SheetTotal: 4
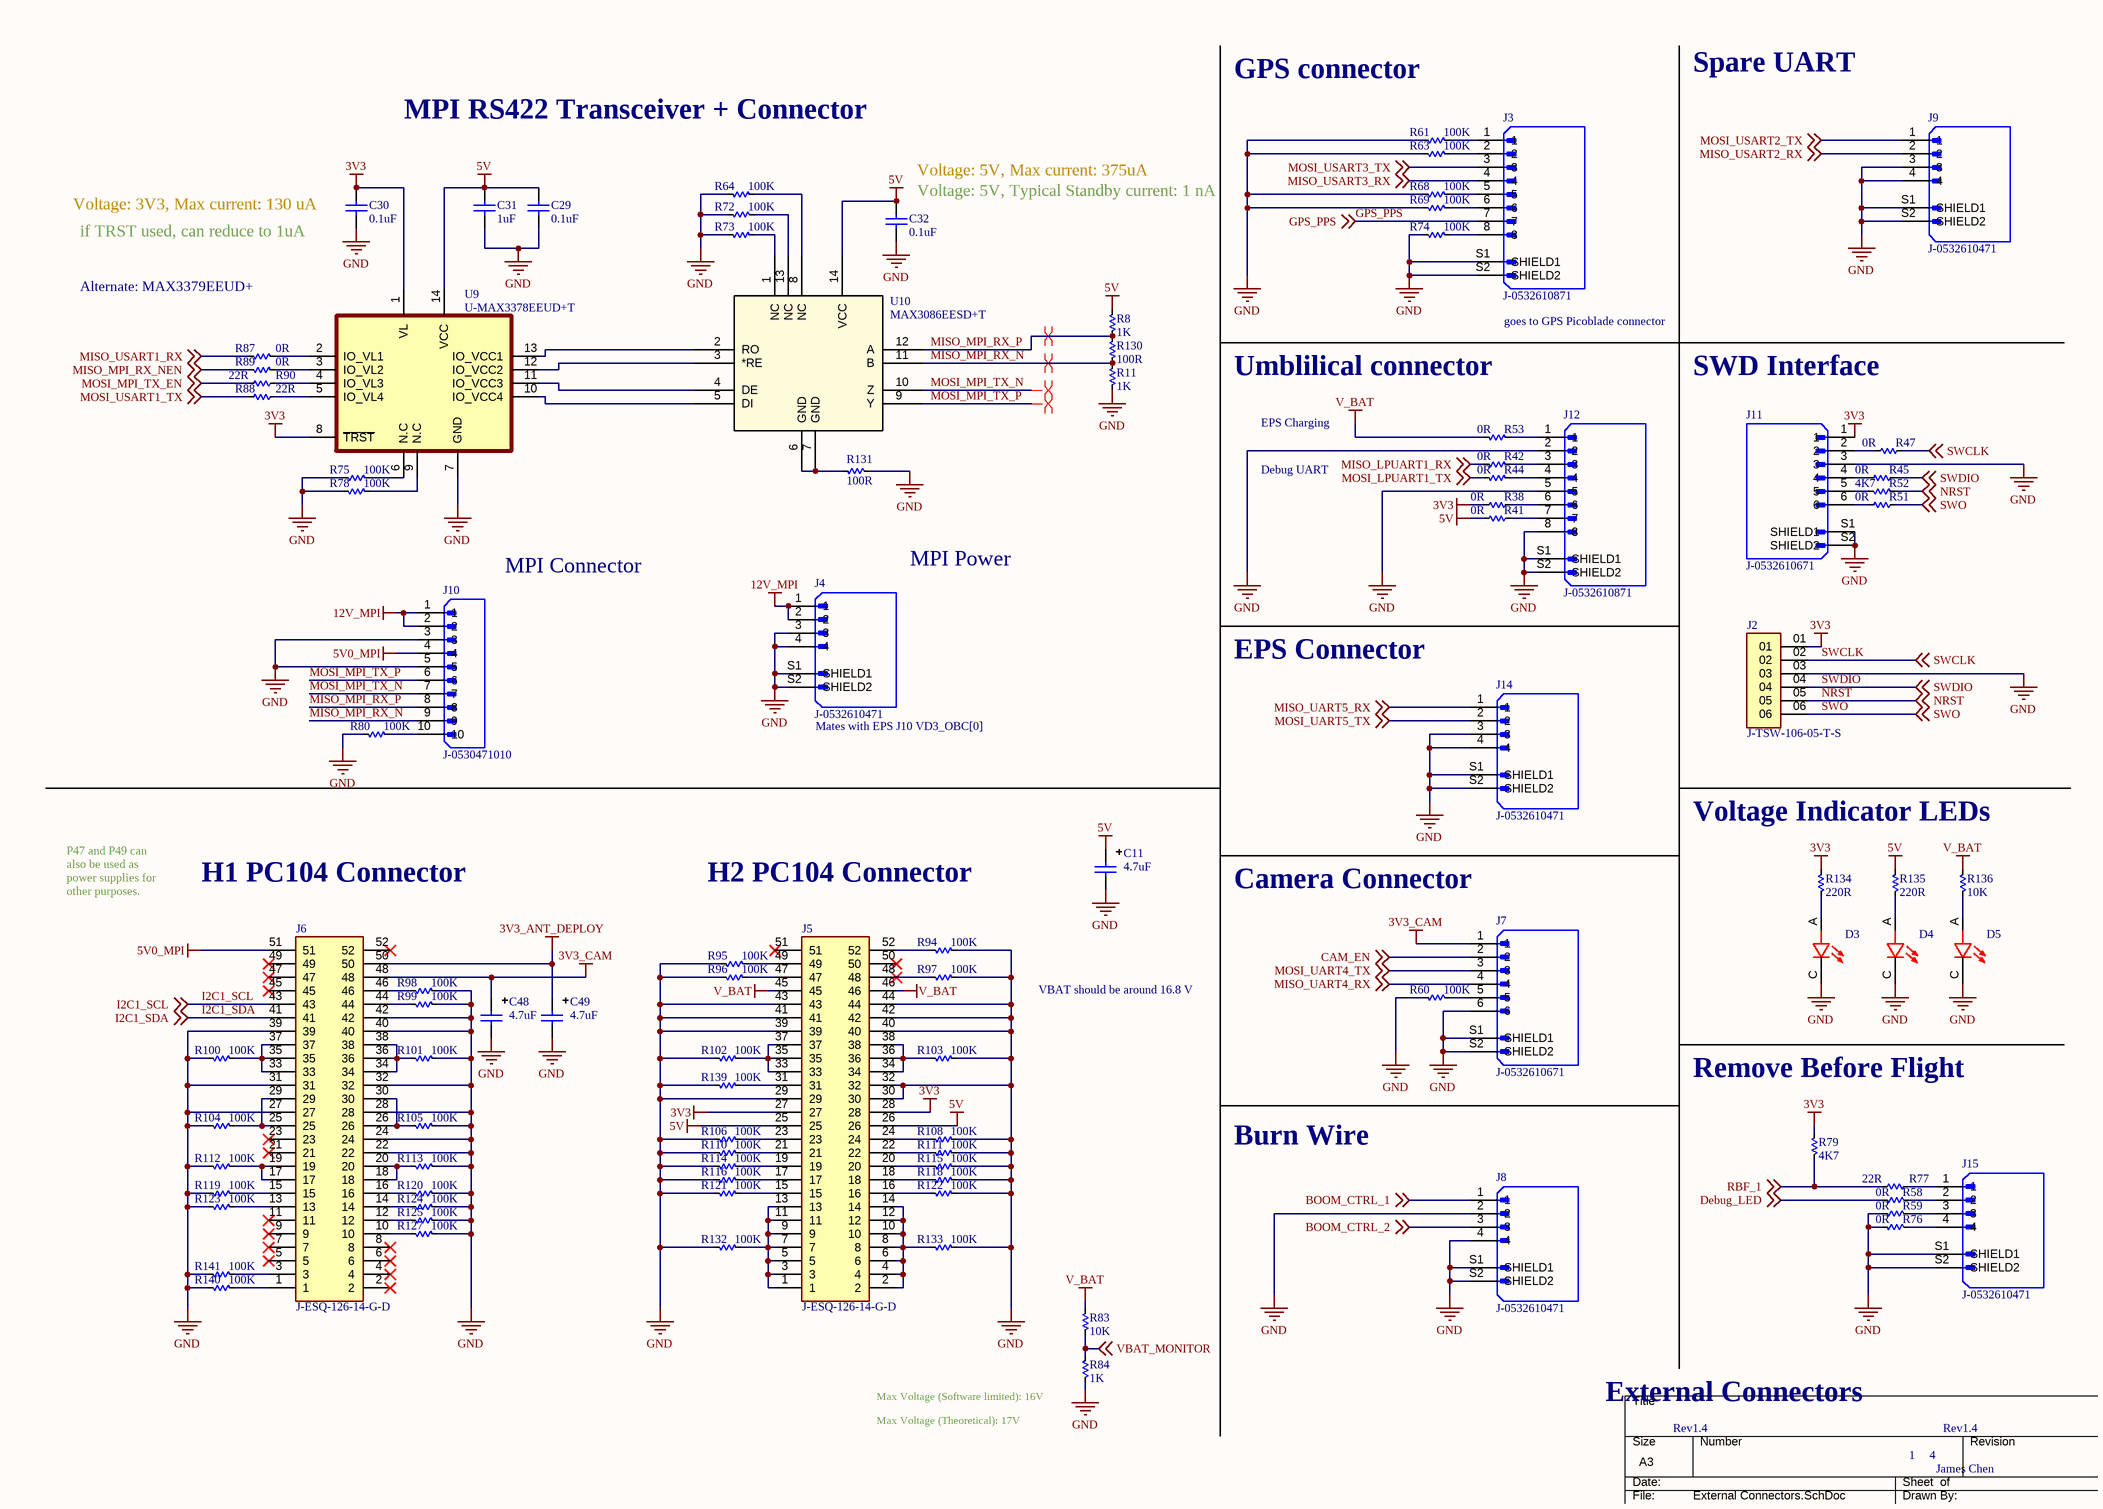
[diagram p2: External Connectors.SchDoc]

### Parts
C11  4.7uF  [CAP TANT 1206 (A) TCJ]
C29  0.1uF  [0603]
C30  0.1uF  [0603]
C31  1uF  [0603]
C32  0.1uF  [0603]
C48  4.7uF  [CAP TANT 1206 (A) TCJ]
C49  4.7uF  [CAP TANT 1206 (A) TCJ]
D3  D-SML-D12U1WT86  [D-SML-D12U1WT86]  (value not drawn)
D4  D-SML-D12U1WT86  [D-SML-D12U1WT86]  (value not drawn)
D5  D-SML-D12U1WT86  [D-SML-D12U1WT86]  (value not drawn)
J2  J-TSW-106-05-T-S  [J-TSW-106-05-T-S]
J3  J-0532610871  [J-532610871]
J4  J-0532610471  [J-53261-0471]
J5  J-ESQ-126-14-G-D  [J-ESQ-126-14-G-D]
J6  J-ESQ-126-14-G-D  [J-ESQ-126-14-G-D]
J7  J-0532610671  [J-0532610671]
J8  J-0532610471  [J-53261-0471]
J9  J-0532610471  [J-53261-0471]
J10  J-0530471010  [J-0530471010]
J11  J-0532610671  [J-0532610671]
J12  J-0532610871  [J-532610871]
J14  J-0532610471  [J-53261-0471]
J15  J-0532610471  [J-53261-0471]
R8  1K  [0603]
R11  1K  [0603]
R38  0R  [0603]
R41  0R  [0603]
R42  0R  [0603]
R44  0R  [0603]
R45  0R  [0603]
R47  0R  [0603]
R51  0R  [0603]
R52  4K7  [0603]
R53  0R  [0603]
R58  0R  [0603]
R59  0R  [0603]
R60  100K  [0603]  (value not drawn)
R61  100K  [0603]  (value not drawn)
R63  100K  [0603]  (value not drawn)
R64  100K  [0603]  (value not drawn)
R68  100K  [0603]  (value not drawn)
R69  100K  [0603]  (value not drawn)
R72  100K  [0603]  (value not drawn)
R73  100K  [0603]  (value not drawn)
R74  100K  [0603]  (value not drawn)
R75  100K  [0603]  (value not drawn)
R76  0R  [0603]
R77  22R  [0603]
R78  100K  [0603]  (value not drawn)
R79  4K7  [0603]
R80  100K  [0603]  (value not drawn)
R83  10K  [0603]
R84  1K  [0603]
R87  0R  [0603]
R88  22R  [0603]
R89  0R  [0603]
R90  22R  [0603]
R94  100K  [0603]  (value not drawn)
R95  100K  [0603]  (value not drawn)
R96  100K  [0603]  (value not drawn)
R97  100K  [0603]  (value not drawn)
R98  100K  [0603]  (value not drawn)
R99  100K  [0603]  (value not drawn)
R100  100K  [0603]  (value not drawn)
R101  100K  [0603]  (value not drawn)
R102  100K  [0603]  (value not drawn)
R103  100K  [0603]  (value not drawn)
R104  100K  [0603]  (value not drawn)
R105  100K  [0603]  (value not drawn)
R106  100K  [0603]  (value not drawn)
R108  100K  [0603]  (value not drawn)
R110  100K  [0603]  (value not drawn)
R111  100K  [0603]  (value not drawn)
R112  100K  [0603]  (value not drawn)
R113  100K  [0603]  (value not drawn)
R114  100K  [0603]  (value not drawn)
R115  100K  [0603]  (value not drawn)
R116  100K  [0603]  (value not drawn)
R118  100K  [0603]  (value not drawn)
R119  100K  [0603]  (value not drawn)
R120  100K  [0603]  (value not drawn)
R121  100K  [0603]  (value not drawn)
R122  100K  [0603]  (value not drawn)
R123  100K  [0603]  (value not drawn)
R124  100K  [0603]  (value not drawn)
R125  100K  [0603]  (value not drawn)
R127  100K  [0603]  (value not drawn)
R130  100R  [0603]
R131  100R  [0603]
R132  100K  [0603]  (value not drawn)
R133  100K  [0603]  (value not drawn)
R134  220R  [0603]
R135  220R  [0603]
R136  10K  [0603]
R139  100K  [0603]  (value not drawn)
R140  100K  [0603]  (value not drawn)
R141  100K  [0603]  (value not drawn)
U9  U-MAX3378EEUD+T  [U-MAX3378EEUD+T]
U10  MAX3086EESD+T  [U-MAX3086EESD+T]

### Nets
3V3: C30.1 J2.01 J5.27 J5.28 J11.1 R38.2 R79.2 R134.2 U9.1(VL) U9.8(~{TRST})
3V3_ANT_DEPLOY: C49.1 J6.50
3V3_CAM: C48.1 J6.48 J7.1
5V: C11.1 C29.1 C31.2 C32.1 J5.25 J5.26 R8.2 R41.2 R135.2 U9.14(VCC) U10.14(VCC)
5V0_MPI: J6.51 J10.4
12V_MPI: J4.1 J4.2 J10.1 J10.2
GND: C11.2 C29.2 C30.2 C31.1 C32.2 C48.2 C49.2 D3.C D4.C D5.C J2.03 J3.S1(SHIELD1) J3.S2(SHIELD2) J4.3 J4.4 J4.S1(SHIELD1) J4.S2(SHIELD2) J5.29 J5.30 J5.32 J5.39 J5.40 J5.41 J5.42 J5.43 J5.44 J6.22 J6.24 J6.27 J6.28 J6.31 J6.32 J6.39 J6.40 J6.42 J7.6 J7.S1(SHIELD1) J7.S2(SHIELD2) J8.2 J8.4 J8.S1(SHIELD1) J8.S2(SHIELD2) J9.3 J9.4 J9.S1(SHIELD1) J9.S2(SHIELD2) J10.3 J10.5 J11.3 J11.S1(SHIELD1) J11.S2(SHIELD2) J12.2 J12.5 J12.8 J12.S1(SHIELD1) J12.S2(SHIELD2) J14.3 J14.4 J14.S1(SHIELD1) J14.S2(SHIELD2) J15.S1(SHIELD1) J15.S2(SHIELD2) R11.1 R59.1 R60.1 R61.1 R63.1 R64.1 R68.1 R69.1 R72.1 R73.1 R74.1 R75.1 R76.1 R78.1 R80.1 R84.1 R94.2 R95.1 R96.1 R97.2 R98.2 R99.2 R100.1 R101.2 R102.1 R103.2 R104.1 R105.2 R106.1 R108.2 R110.1 R111.2 R112.1 R113.2 R114.1 R115.2 R116.1 R118.2 R119.1 R120.2 R121.1 R122.2 R123.1 R124.2 R125.2 R127.2 R131.1 R132.1 R133.2 R139.1 R140.1 R141.1 U9.7(GND)
V_BAT: J5.45 J5.46 R53.1 R83.2 R136.2
BOOM_CTRL_1: J8.1 ; off-sheet BOOM_CTRL_1
BOOM_CTRL_2: J8.3 ; off-sheet BOOM_CTRL_2
CAM_EN: J7.2 ; off-sheet CAM_EN
Debug_LED: R58.1 ; off-sheet Debug_LED
GPS_PPS: J3.7 ; off-sheet GPS_PPS
I2C1_SCL: J6.43 ; off-sheet I2C1_SCL
I2C1_SDA: J6.41 ; off-sheet I2C1_SDA
MISO_LPUART1_RX: R42.1 ; off-sheet MISO_LPUART1_RX
MISO_MPI_RX_N: J10.9 R11.2 R130.1 U10.11(B)
MISO_MPI_RX_NEN: R89.1 ; off-sheet MISO_MPI_RX_NEN
MISO_MPI_RX_P: J10.8 R8.1 R130.2 U10.12(A)
MISO_UART4_RX: J7.4 ; off-sheet MISO_UART4_RX
MISO_UART5_RX: J14.1 ; off-sheet MISO_UART5_RX
MISO_USART1_RX: R87.1 ; off-sheet MISO_USART1_RX
MISO_USART2_RX: J9.2 ; off-sheet MISO_USART2_RX
MISO_USART3_RX: J3.4 ; off-sheet MISO_USART3_RX
MOSI_LPUART1_TX: R44.1 ; off-sheet MOSI_LPUART1_TX
MOSI_MPI_TX_EN: R90.1 ; off-sheet MOSI_MPI_TX_EN
MOSI_MPI_TX_N: J10.7 U10.10(Z)
MOSI_MPI_TX_P: J10.6 U10.9(Y)
MOSI_UART4_TX: J7.3 ; off-sheet MOSI_UART4_TX
MOSI_UART5_TX: J14.2 ; off-sheet MOSI_UART5_TX
MOSI_USART1_TX: R88.2 ; off-sheet MOSI_USART1_TX
MOSI_USART2_TX: J9.1 ; off-sheet MOSI_USART2_TX
MOSI_USART3_TX: J3.3 ; off-sheet MOSI_USART3_TX
NRST: J2.05 R52.1 ; off-sheet NRST
RBF_1: R77.1 R79.1 ; off-sheet RBF_1
SWCLK: J2.02 R47.1 ; off-sheet SWCLK
SWDIO: J2.04 R45.1 ; off-sheet SWDIO
SWO: J2.06 R51.1 ; off-sheet SWO
VBAT_MONITOR: R83.1 R84.2 ; off-sheet VBAT_MONITOR
NetD3_A: D3.A R134.1
NetD4_A: D4.A R135.1
NetD5_A: D5.A R136.1
NetJ3_1: J3.1 R61.2
NetJ3_2: J3.2 R63.2
NetJ3_5: J3.5 R68.2
NetJ3_6: J3.6 R69.2
NetJ3_8: J3.8 R74.2
NetJ5_1: J5.1 J5.3 J5.5 J5.7 J5.9 J5.11 J5.13 R132.2
NetJ5_2: J5.2 J5.4 J5.6 J5.8 J5.10 J5.12 J5.14 R133.1
NetJ5_15: J5.15 R121.2
NetJ5_16: J5.16 R122.1
NetJ5_17: J5.17 R116.2
NetJ5_18: J5.18 R118.1
NetJ5_19: J5.19 R114.2
NetJ5_20: J5.20 R115.1
NetJ5_21: J5.21 R110.2
NetJ5_22: J5.22 R111.1
NetJ5_23: J5.23 R106.2
NetJ5_24: J5.24 R108.1
NetJ5_31: J5.31 R139.2
NetJ5_33: J5.33 J5.35 J5.37 R102.2
NetJ5_34: J5.34 J5.36 J5.38 R103.1
NetJ5_47: J5.47 R96.2
NetJ5_48: J5.48 R97.1
NetJ5_49: J5.49 R95.2
NetJ5_52: J5.52 R94.1
NetJ6_1: J6.1 R140.2
NetJ6_3: J6.3 R141.2
NetJ6_10: J6.10 R127.1
NetJ6_12: J6.12 R125.1
NetJ6_13: J6.13 R123.2
NetJ6_14: J6.14 R124.1
NetJ6_15: J6.15 R119.2
NetJ6_16: J6.16 R120.1
NetJ6_17: J6.17 J6.19 R112.2
NetJ6_18: J6.18 J6.20 R113.1
NetJ6_25: J6.25 J6.29 R104.2
NetJ6_26: J6.26 J6.30 R105.1
NetJ6_33: J6.33 J6.35 J6.37 R100.2
NetJ6_34: J6.34 J6.36 J6.38 R101.1
NetJ6_44: J6.44 R99.1
NetJ6_46: J6.46 R98.1
NetJ7_5: J7.5 R60.2
NetJ10_10: J10.10 R80.2
NetJ11_2: J11.2 R47.2
NetJ11_4: J11.4 R45.2
NetJ11_5: J11.5 R52.2
NetJ11_6: J11.6 R51.2
NetJ12_1: J12.1 R53.2
NetJ12_3: J12.3 R42.2
NetJ12_4: J12.4 R44.2
NetJ12_6: J12.6 R38.1
NetJ12_7: J12.7 R41.1
NetJ15_1: J15.1 R77.2
NetJ15_2: J15.2 R58.2
NetJ15_3: J15.3 R59.2
NetJ15_4: J15.4 R76.2
NetR64_2: R64.2 U10.8(NC)
NetR72_2: R72.2 U10.13(NC)
NetR73_2: R73.2 U10.1(NC)
NetR75_2: R75.2 U9.6(N.C)
NetR78_2: R78.2 U9.9(N.C)
NetR87_2: R87.2 U9.2(IO_VL1)
NetR88_1: R88.1 U9.5(IO_VL4)
NetR89_2: R89.2 U9.3(IO_VL2)
NetR90_2: R90.2 U9.4(IO_VL3)
NetR131_2: R131.2 U10.6(GND) U10.7(GND)
NetU9_10: U9.10(IO_VCC4) U10.5(DI)
NetU9_11: U9.11(IO_VCC3) U10.4(DE)
NetU9_12: U9.12(IO_VCC2) U10.3(*RE)
NetU9_13: U9.13(IO_VCC1) U10.2(RO)

Not connected (* = marked no-connect by the designer): J5 50* 51*; J6 2* 4* 5* 6* 7* 8* 9* 11* 21* 23* 45* 47* 49* 52*

### Layout directives
differential pair; net class DIF 100 OHMS: MISO_MPI_RX_N, MISO_MPI_RX_P, MOSI_MPI_TX_N, MOSI_MPI_TX_P

### Notes on the sheet
- GPS connector
- Spare UART
- MPI RS422 Transceiver + Connector
- (near C32) Voltage: 5V, Max current: 375uA
- (near C30) Voltage: 3V3, Max current: 130 uA
- (near C30) if TRST used, can reduce to 1uA
- (near C32) Voltage: 5V, Typical Standby current: 1 nA
- Alternate: MAX3379EEUD+
- Umblilical connector
- (near J3) goes to GPS Picoblade connector
- SWD Interface
- EPS Charging
- Debug UART
- (near J10) MPI Connector
- (near J4) MPI Power
- EPS Connector
- (near J4) Mates with EPS J10 VD3_OBC[0]
- Voltage Indicator LEDs
- P47 and P49 can also be used as power supplies for other purposes.
- H1 PC104 Connector
- H2 PC104 Connector
- Camera Connector
- VBAT should be around 16.8 V
- (near R79) Remove Before Flight
- Burn Wire
- (near R84) Max Voltage (Software limited): 16V
  Max Voltage (Theoretical): 17V
- External Connectors
- Rev1.4
- 1
- 4
- James Chen
- THIS DOCUMENT AND THE DATA DISCLOSED HEREIN OR
- HEREWITH IS THE PROPERTY OF ALTIUM LIMITED AND MAY
- DWG NO:
- REVISION
- REV:
- DESCRIPTION
- DATE
- APPROVED
- BE FREELY DISTRIBUTED IN WHOLE. NO RIGHTS ARE
- RESERVED OR EXPRESS OR IMPLIED WARANTEE GIVEN.
- ENG:
- APPROVALS
- PROJECT
- DSN:
- CHK:
- REFERENCE DOCUMENTS
- PROJECT REVISION:
- TITLE
- DOCUMENT REVISION:
- DESIGN ITEM:
- BOM:
- FAB DWG:
- PCB DWG:
- ASSY DWG:
- SCALE:
- A3
- SIZE
- CAGE CODE
- FILE NAME
- DWG NO.
- SHEET
- OF
- REV

### Library data of the parts
C11 C48 C49 = CT-474-M-20V-OTH-1206: as C13 on sheet STM32; ComponentLink1Description: Datasheet; ComponentLink1URL: *; ComponentLink2Description: Manufacturer Website; ComponentLink2URL: *; Distributor: Digikey; Distributor Part #: 478-1668-1-ND; Part Description: 4.7 µF Molded Tantalum Capacitors 20 V 1206 (3216 Metric) 4Ohm; Value: 4.7uF
C29 C30 C32 = CC-100nF-25V-X7R-0603: as C1 on sheet STM32; ComponentLink1description: Datasheet; ComponentLink1URL: https://ds.yuden.co.jp/TYCOMPAS/ut/detail?pn=TMK105BJ104KV-F%20%20&u=M; ComponentLink2description: Manufacturer Website; Distributor: LCSC; Distributor Part #: C354391; Part Description: 25V 100nF X7R ±10% 0603 Multilayer Ceramic Capacitors MLCC - SMD/SMT ROHS; ComponentLink2URL: https://www.yuden.co.jp/or/; Value: 0.1uF; Highest Rated Operating Temperature: 125; Lowest Rated Operating Temperature: -55
C31 = CC-105-K-25V-X7R-0603: as C2 on sheet STM32; ComponentLink1Description: Datasheet; ComponentLink1URL: https://www.yageo.com/upload/media/product/productsearch/datasheet/mlcc/UPY-GPHC_X7R_6.3V-to-50V_18.pdf; ComponentLink2Description: Manufacture Website; ComponentLink2URL: https://www.yageo.com/en/Home; Distributor: Digikey; Distributor Part #: 311-1802-1-ND; Part Description: CAP CER 1UF 25V X7R 0603; SignalCraft Part #: CC-105-K-25V-X7R-0603; Value: 1uF
D3-D5 = D-SML-D12U1WT86: as D1 on sheet STM32; Manufacturer Part #: SML-D12U1WT86; Distributor: Digikey; Distributor Part #: SML-D12U1WT86CT-ND
J2 = J-TSW-106-05-T-S: CONN HEADER VERT 6POS 2.54MM; Distrbutor part #: SAM12323-ND; Manufacturer: Samtec; Distrbutor: None; Manufacturer Part #: TSW-106-05-T-S; Price: None
J3 J12 = J-0532610871: CONN HEADER SMD R/A 8POS 1.25MM; Manfacturer: Molex; Manfacturer Part #: 0532610871; Distributor Part #: WM7626CT-ND; Distributor: Digi-Key
J4 J8 J9 J14 J15 = J-0532610471: CONN HEADER SMD R/A 4POS 1.25MM; Manfacturer: Molex; Manfacturer Part #: 0532610471; Distributor Part #: WM7622CT-ND; Distributor: Digi-Key
J5 J6 = J-ESQ-126-14-G-D: CONN SOCKET 52POS 0.1 GOLD PCB; Manufacturer: Samtec Inc.; Manufacturer Part #: ESQ-126-14-G-D; Distributor: Digikey; Distributor Part #: SAM11114-ND
J7 J11 = J-0532610671: CONN HEADER SMD R/A 6POS 1.25MM; Manfacturer: Molex; Distributor: Digi-Key; Manfacturer Part #: 0532610671; Distributor Part #: WM7624CT-ND
J10 = J-0530471010: CONN HEADER VERT 10POS 1.25MM; Manufacturer: Molex; Manufacturer Part #: 0530471010; Distributor: Digikey; Distributor Part #: WM1739-ND
R8 R11 R84 = RT-1K0-F-1/16W-0603: as R15 on sheet STM32; ComponentLink1description: Datasheet; ComponentLink1URL: https://www.vishay.com/docs/20035/dcrcwe3.pdf; ComponentLink2description: Manufacturer Website; Distributor: Digikey; Distributor Part #: A102226CT-ND; Part Description: RES SMD 1K OHM 1% 1/16W 0603; ComponentLink2URL: https://www.vishay.com/; Value: 1K
R38 R41 R42 R44 R45 R47 R51 R53 R58 R59 R76 R87 R89 = RT-0R00-F-1/10W-0603: as R4 on sheet STM32; ComponentLink1description: Datasheet; ComponentLink1URL: https://industrial.panasonic.com/ww/products/resistors/chip-resistors/general-purpose-chip-resistors/models/ERJ2GE0R00X; ComponentLink2description: Manufacturer Website; Distributor: Digikey; Distributor Part #: RMCF0603ZT0R00CT-ND; Part Description: 0 Ohms Jumper 0.1W, 1/10W Chip Resistor 0603 (1608 Metric) Automotive AEC-Q200 Thick Film; ComponentLink2URL: https://industrial.panasonic.com/ww/products/resistors/chip-resistors/general-purpose-chip-resistors/models/ERJ2GE0R00X; Value: 0R
R52 R79 = RT-4K7-F-1/16W-0603: as R1 on sheet STM32; ComponentLink1description: Datasheet; ComponentLink1URL: https://www.vishay.com/docs/20035/dcrcwe3.pdf; ComponentLink2description: Manufacturer Website; Distributor: Digikey; Distributor Part #: CR0603-FX-4701ELFCT-ND; Part Description: RES SMD 4.7K OHM 1% 1/10W 0603; ComponentLink2URL: https://www.vishay.com/; Value: 4K7
R60 R61 R63 R64 R68 R69 R72-R75 R78 R80 R94-R106 R108 R110-R116 R118-R125 R127 R132 R133 R139-R141 = RT-100K0-F-1/16W-0603: RES SMD 100KΩ 0.1% 1/16W 0603; Manufacturer: TE Connectivity; Manufacturer Part #: CPF0603B100KE; ComponentLink2URL: https://www.te.com/commerce/DocumentDelivery/DDEController?Action=showdoc&DocId=Data+Sheet%7F1773200%7FM%7Fpdf%7FEnglish%7FENG_DS_1773200_M.pdf%7F3-1676481-2; ComponentLink2Description: Datasheet; Distributor: Digikey; Distributor Part #: A119912CT-ND; Part Description: RES SMD 100KΩ 0.1% 1/16W 0603; Value: 100K
R77 R88 R90 = RT-22R0-F-1/16W-0603: as R9 on sheet STM32; ComponentLink1description: Datasheet; ComponentLink1URL: https://www.vishay.com/docs/20035/dcrcwe3.pdf; ComponentLink2description: Manufacturer Website; Distributor: Digikey; Distributor Part #: RR08Q22DCT-ND; Part Description: 22 Ohms ±0.5% 0.063W, 1/16W Chip Resistor 0603 (1608 Metric) - Thin Film; ComponentLink2URL: https://www.vishay.com/; Value: 22R
R83 = RT-10K0-F-1/16W-0603: RES 10K OHM 1% 1/8W 0603; Manufacturer: Stackpole Electronics Inc; Manufacturer Part #: RNCP0603FTD10K0; ComponentLink1description: Datasheet; ComponentLink1URL: https://www.vishay.com/docs/20035/dcrcwe3.pdf; ComponentLink2description: Manufacturer Website; Distributor: Digikey; Distributor Part #: RNCP0603FTD10K0CT-ND; Part Description: RES 10K OHM 1% 1/8W 0603; ComponentLink2URL: https://www.vishay.com/; Value: 10K
R130 R131 = RT-100R-F-1/16W-0603: RES SMD 100 OHM 0.5% 1/16W 0603; Manufacturer: Susumu; Manufacturer Part #: RR08P100DCT-ND; Distributor: Digikey; Distributor Part #: RR08P100DCT-ND; Part Description: RES SMD 100 OHM 0.5% 1/16W 0603; Value: 100R
R134 R135 = RT-220R-F-1/16W-0603: 220 Ohms ±0.5% 0.063W, 1/16W Chip Resistor 0603 (1608 Metric) - Thin Film; Manufacturer: Susumu; Manufacturer Part #: RR0816P-221-D; Distributor: Digikey; Distributor Part #: RR08P220DCT-ND; Part Description: 220 Ohms ±0.5% 0.063W, 1/16W Chip Resistor 0603 (1608 Metric) - Thin Film; Value: 220R
R136 = RT-10K0-F-1/16W-0603: as R34 on sheet Memory; ComponentLink1description: Datasheet; ComponentLink1URL: https://www.vishay.com/docs/20035/dcrcwe3.pdf; ComponentLink2description: Manufacturer Website; Distributor: Digikey; Distributor Part #: A119886CT-ND; Part Description: 10 kOhms ±0.1% 0.063W, 1/16W Chip Resistor 0603 (1608 Metric) - Thin Film; ComponentLink2URL: https://www.vishay.com/; Value: 10K
U9 = U-MAX3378EEUD+T: IC TRNSLTR BIDIRECTIONAL 14TSSOP; Manufacturer: Maxim Integrated; Manufacturer Part #: MAX3378EEUD+T; Distributor: Digikey; Distributor Part #: MAX3378EEUD+TCT-ND; LCSC Part #: C143441
U10 = U-MAX3086EESD+T: IC TRANSCEIVER FULL 1/1 14SOIC; Manufacturer: Maxim Integrated Products; Manufacturer Part #: MAX3086EESD+T; Distributor: Digikey; Distributor Part #: MAX3086EESD+TCT-ND; Type: DEV; LCSC Part #: C2671104

## Sheet Antenna and LoRa.SchDoc
size A3; SheetNumber: 4; SheetTotal: 4
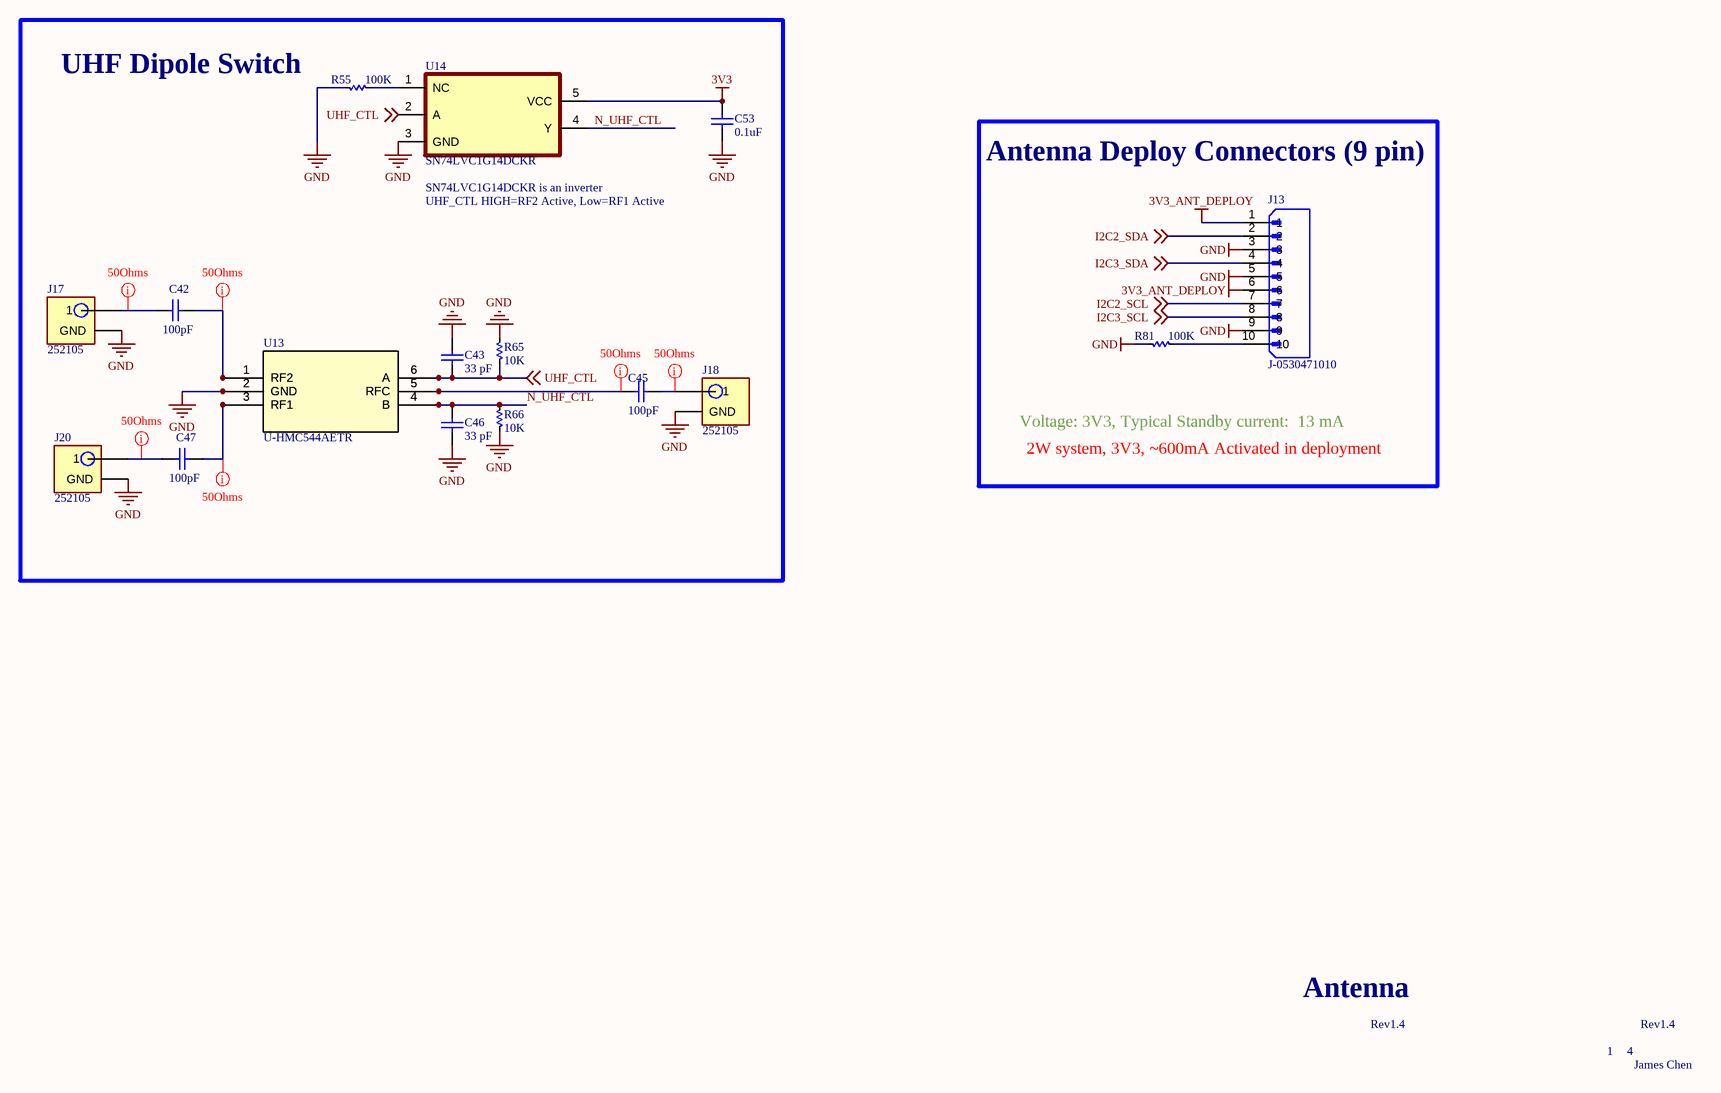
[diagram p3: Antenna and LoRa.SchDoc]

### Parts
C42  100pF  [0603]
C43  33 pF  [0603]
C45  100pF  [0603]
C46  33 pF  [0603]
C47  100pF  [0603]
C53  0.1uF  [0603]
J13  J-0530471010  [J-0530471010]
J17  252105  [J-252105]
J18  252105  [J-252105]
J20  252105  [J-252105]
R55  100K  [0603]  (value not drawn)
R65  10K  [0603]
R66  10K  [0603]
R81  100K  [0603]  (value not drawn)
U13  U-HMC544AETR  [U-HMC544AETR]
U14  SN74LVC1G14DCKR  [U-SN74LVC1G14DCKR]

### Blocks framed on the sheet
UHF Dipole Switch: C42 C43 C45-C47 C53 J17 J18 J20 R55 R65 R66 U13 U14
Antenna Deploy Connectors (9 pin): J13 R81

### Nets
3V3: C53.2 U14.5(VCC)
3V3_ANT_DEPLOY: J13.1 J13.6
GND: C43.2 C46.1 C53.1 J13.3 J13.5 J13.9 J17.0(GND) J18.0(GND) J20.0(GND) R55.1 R65.2 R66.1 R81.1 U13.2(GND) U14.3(GND)
I2C2_SCL: J13.7 ; off-sheet I2C2_SCL
I2C2_SDA: J13.2 ; off-sheet I2C2_SDA
I2C3_SCL: J13.8 ; off-sheet I2C3_SCL
I2C3_SDA: J13.4 ; off-sheet I2C3_SDA
N_UHF_CTL: C46.2 R66.2 U13.4(B) U14.4(Y)
UHF_CTL: C43.1 R65.1 U13.6(A) U14.2(A) ; off-sheet UHF_CTL
NetC42_1: C42.1 J17.1
NetC42_2: C42.2 U13.1(RF2)
NetC45_1: C45.1 U13.5(RFC)
NetC45_2: C45.2 J18.1
NetC47_1: C47.1 J20.1
NetC47_2: C47.2 U13.3(RF1)
NetJ13_10: J13.10 R81.2
NetR55_2: R55.2 U14.1(NC)

### Layout directives
net class 50Ohms: NetC42_1, NetC42_2, NetC45_1, NetC45_2, NetC47_1, NetC47_2

### Notes on the sheet
- (near U14) SN74LVC1G14DCKR is an inverter
- UHF_CTL HIGH=RF2 Active, Low=RF1 Active
- Voltage: 3V3, Typical Standby current:  13 mA
- 2W system, 3V3, ~600mA Activated in deployment
- Antenna
- Rev1.4
- 1
- 4
- James Chen
- THIS DOCUMENT AND THE DATA DISCLOSED HEREIN OR
- HEREWITH IS THE PROPERTY OF ALTIUM LIMITED AND MAY
- DWG NO:
- REVISION
- REV:
- DESCRIPTION
- DATE
- APPROVED
- BE FREELY DISTRIBUTED IN WHOLE. NO RIGHTS ARE
- RESERVED OR EXPRESS OR IMPLIED WARANTEE GIVEN.
- ENG:
- APPROVALS
- PROJECT
- DSN:
- CHK:
- REFERENCE DOCUMENTS
- PROJECT REVISION:
- TITLE
- DOCUMENT REVISION:
- DESIGN ITEM:
- BOM:
- FAB DWG:
- PCB DWG:
- ASSY DWG:
- SCALE:
- A3
- SIZE
- CAGE CODE
- FILE NAME
- DWG NO.
- SHEET
- OF
- REV

### Library data of the parts
C42 C45 C47 = CC-104-K-25V-X5R-0402: CAP CER 100PF 50V X7R 0603; Manufacturer: YAGEO; Manufacturer Part #: CC0603KRX7R9BB101; ComponentLink1description: Datasheet; ComponentLink1URL: https://ds.yuden.co.jp/TYCOMPAS/ut/detail?pn=TMK105BJ104KV-F%20%20&u=M; ComponentLink2description: Manufacturer Website; Distributor: Digikey; Distributor Part #: 311-3601-1-ND; Part Description: CAP CER 100PF 50V X7R 0603; ComponentLink2URL: https://www.yuden.co.jp/or/; Value: 100pF
C43 C46 = CC-339-K-50V-X7R-0603: CAP CER 33PF 50V X7R 0603; Manufacturer: KEMET; Manufacturer Part #: C0603C330K5RAC7867; ComponentLink1description: Datasheet; ComponentLink1URL: https://ds.yuden.co.jp/TYCOMPAS/ut/detail?pn=TMK105BJ104KV-F%20%20&u=M; ComponentLink2description: Manufacturer Website; Distributor: Digikey; Distributor Part #: 399-C0603C330K5RAC7867CT-ND; Part Description: CAP CER 33PF 50V X7R 0603; ComponentLink2URL: https://www.yuden.co.jp/or/; Value: 33 pF
C53 = CC-100nF-25V-X7R-0603: as C1 on sheet STM32; ComponentLink1description: Datasheet; ComponentLink1URL: https://ds.yuden.co.jp/TYCOMPAS/ut/detail?pn=TMK105BJ104KV-F%20%20&u=M; ComponentLink2description: Manufacturer Website; Distributor: LCSC; Distributor Part #: C354391; Part Description: 25V 100nF X7R ±10% 0603 Multilayer Ceramic Capacitors MLCC - SMD/SMT ROHS; ComponentLink2URL: https://www.yuden.co.jp/or/; Value: 0.1uF; Highest Rated Operating Temperature: 125; Lowest Rated Operating Temperature: -55
J13 = J-0530471010: as J10 on sheet External Connectors; Manufacturer Part #: 0530471010; Distributor: Digikey; Distributor Part #: WM1739-ND
J17 J18 J20 = J-252105: CONN MCX RCPT STR 50 OHM PCB; Manufacturer: Amphenol RF; Manufacturer Part #: 252105; Distributor Part #: ACX1262-ND; Distributor: Digikey
R55 R81 = RT-100K0-F-1/16W-0603: as R60 on sheet External Connectors; ComponentLink2URL: https://www.te.com/commerce/DocumentDelivery/DDEController?Action=showdoc&DocId=Data+Sheet%7F1773200%7FM%7Fpdf%7FEnglish%7FENG_DS_1773200_M.pdf%7F3-1676481-2; ComponentLink2Description: Datasheet; Distributor: Digikey; Distributor Part #: A119912CT-ND; Part Description: RES SMD 100KΩ 0.1% 1/16W 0603; Value: 100K
R65 R66 = RT-10K0-F-1/16W-0603: as R34 on sheet Memory; ComponentLink1description: Datasheet; ComponentLink1URL: https://www.vishay.com/docs/20035/dcrcwe3.pdf; ComponentLink2description: Manufacturer Website; Distributor: Digikey; Distributor Part #: A119886CT-ND; Part Description: 10 kOhms ±0.1% 0.063W, 1/16W Chip Resistor 0603 (1608 Metric) - Thin Film; ComponentLink2URL: https://www.vishay.com/; Value: 10K
U13 = U-HMC544AETR: 0Hz~4GHz 23dB 0.7dB SOT-23-6 RF Switches ROHS; Manufacturer: Analog Devices; Manufacturer Part #: HMC544AETR; Distributor: LCSC; Distributor Part #: C579555; LCSC Part #: C579555
U14 = U-SN74LVC1G14DCKR: IC INVERT SCHMITT 1CH 1IN SC70; Manufacturer: Texas Instruments; Distributor: Digikey; Manufacturer Part #: SN74LVC1G14DCKR; Distributor Part #: 296-11608-1-ND; LCSC Part #: C35740

## Nets that join several sheets
3V3: STM32 (50 pins), Memory (24 pins), External Connectors (10 pins), Antenna and LoRa (C53.2 U14.5)
3V3_ANT_DEPLOY: External Connectors (C49.1 J6.50), Antenna and LoRa (J13.1 J13.6)
GND: STM32 (55 pins), Memory (12 pins), External Connectors (115 pins), Antenna and LoRa (15 pins)
BOOM_CTRL_1: STM32 (R10.2), External Connectors (J8.1)
BOOM_CTRL_2: STM32 (R39.1), External Connectors (J8.3)
CAM_EN: STM32 (R31.1), External Connectors (J7.2)
Debug_LED: STM32 (R1.2 U1.1), External Connectors (R58.1)
GPS_PPS: STM32 (R30.2), External Connectors (J3.7)
I2C1_SCL: STM32 (R91.1 U1.129), External Connectors (J6.43)
I2C1_SDA: STM32 (R92.2 U1.128), External Connectors (J6.41)
I2C2_SCL: STM32 (R19.2 U1.11), Antenna and LoRa (J13.7)
I2C2_SDA: STM32 (R20.2 U1.10), Antenna and LoRa (J13.2)
I2C3_SCL: STM32 (R54.2 U1.26), Antenna and LoRa (J13.8)
I2C3_SDA: STM32 (R49.2 U1.27), Antenna and LoRa (J13.4)
MISO_LPUART1_RX: STM32 (R18.1 R138.2), External Connectors (R42.1)
MISO_MPI_RX_NEN: STM32 (R46.2), External Connectors (R89.1)
MISO_UART4_RX: STM32 (R29.1), External Connectors (J7.4)
MISO_UART5_RX: STM32 (R56.2), External Connectors (J14.1)
MISO_USART1_RX: STM32 (R109.1), External Connectors (R87.1)
MISO_USART2_RX: STM32 (R57.2 R137.1), External Connectors (J9.2)
MISO_USART3_RX: STM32 (R23.2), External Connectors (J3.4)
MOSI_LPUART1_TX: STM32 (R21.1), External Connectors (R44.1)
MOSI_MPI_TX_EN: STM32 (R43.2), External Connectors (R90.1)
MOSI_UART4_TX: STM32 (R25.1), External Connectors (J7.3)
MOSI_UART5_TX: STM32 (R40.2), External Connectors (J14.2)
MOSI_USART1_TX: STM32 (R107.1), External Connectors (R88.2)
MOSI_USART2_TX: STM32 (R16.2), External Connectors (J9.1)
MOSI_USART3_TX: STM32 (R50.1), External Connectors (J3.3)
NRST: STM32 (C19.2 R15.2 U1.25), External Connectors (J2.05 R52.1)
RBF_1: STM32 (U1.75), External Connectors (R77.1 R79.1)
SPI1_MISO: STM32 (R28.2), Memory (6 pins)
SPI1_MOSI: STM32 (R9.1), Memory (6 pins)
SPI1_SCLK: STM32 (R12.1), Memory (6 pins)
SPI_NCS_FLASH_0: STM32 (R24.2), Memory (R117.2 U2.7)
SPI_NCS_FLASH_1: STM32 (R32.2), Memory (R126.2 U5.7)
SPI_NCS_FLASH_2: STM32 (R22.2), Memory (R35.2 U3.7)
SPI_NCS_FLASH_3: STM32 (R17.2), Memory (R34.2 U6.7)
SPI_NCS_FRAM_0: STM32 (R27.2), Memory (R129.2 U8.1)
SPI_NCS_FRAM_1: STM32 (R26.2), Memory (R128.2 U7.1)
SWCLK: STM32 (U1.109), External Connectors (J2.02 R47.1)
SWDIO: STM32 (U1.105), External Connectors (J2.04 R45.1)
SWO: STM32 (U1.133), External Connectors (J2.06 R51.1)
UHF_CTL: STM32 (R67.1), Antenna and LoRa (C43.1 R65.1 U13.6 U14.2)
VBAT_MONITOR: STM32 (U1.28), External Connectors (R83.1 R84.2)

## Assembly variants
Build: not fitted C37 C38 C40 C41 J1 J2 J15 J19